# EAGLE schematic Power (EAGLE 9.6.2)
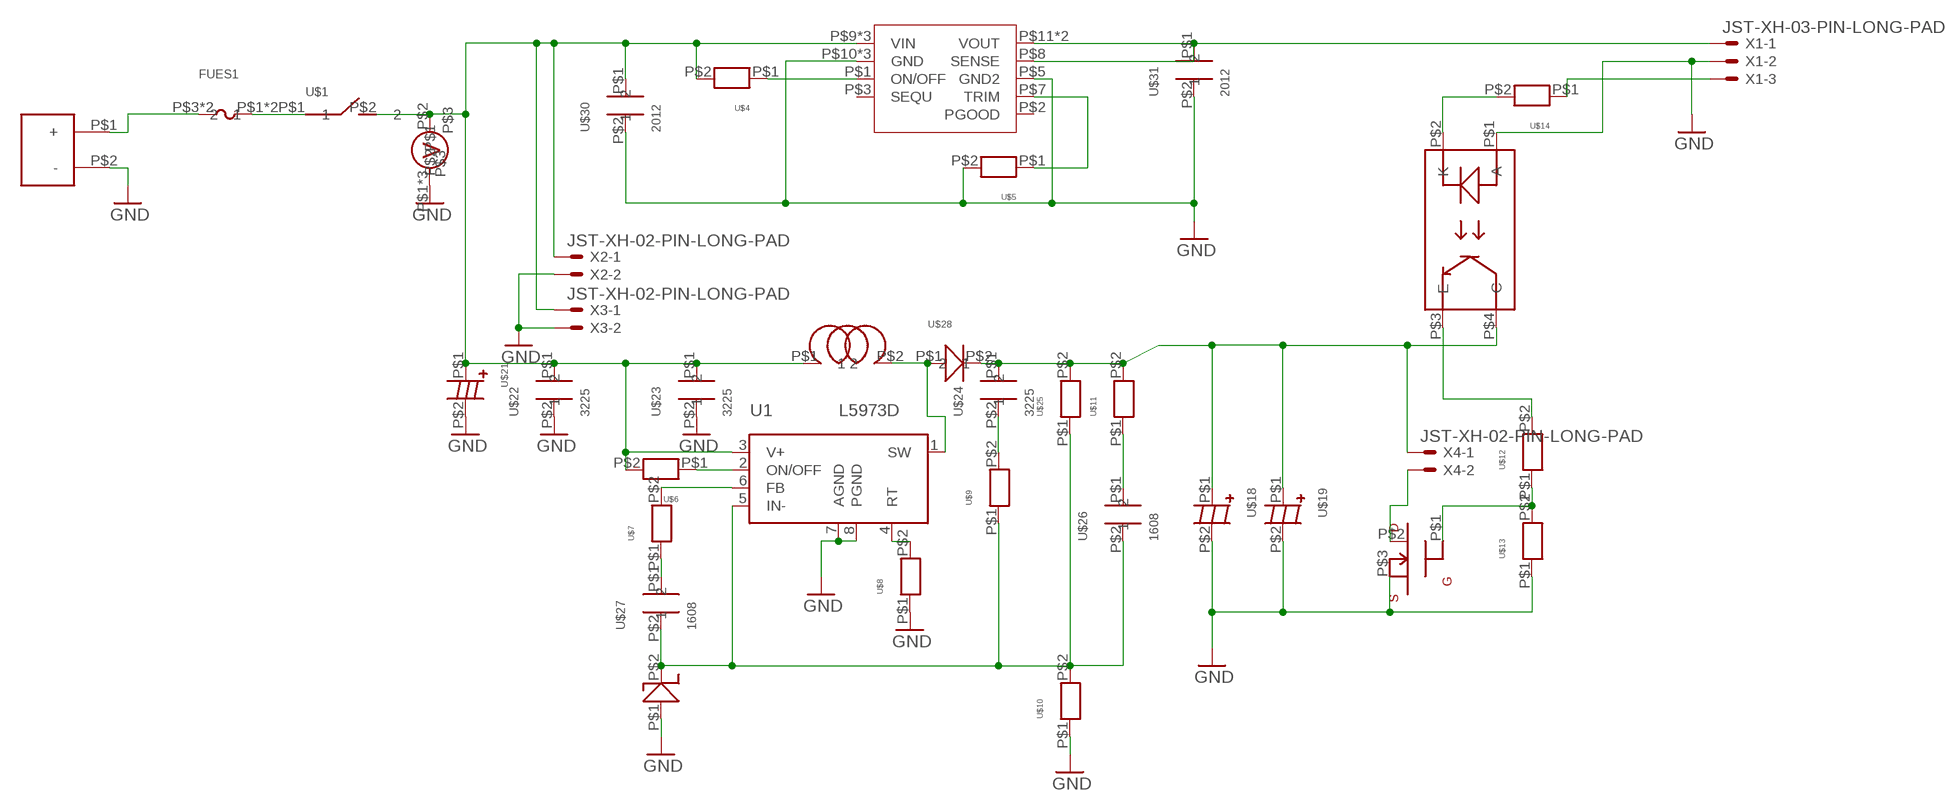
[diagram p0: schematic, sheet 1]

## Parts
FUES1  FUSE  [FUSE]
U1  L5973D  [HSOP8]
U$1  SW  [SW]
U$2  V  [V]
U$3  DCDC  [DC-DC]
U$4  R  [1608]
U$5  R  [1608]
U$6  R  [1608]
U$7  R  [1608]
U$8  R  [1608]
U$9  R  [1608]
U$10  R  [1608]
U$11  R  [1608]
U$12  R  [1608]
U$13  R  [1608]
U$14  R  [1608]
U$15  PHOTOCOUPLER  [PHOTOCOUPLER]
U$16  XT60  [XT60]
U$17  MOS  [MOS]
U$18  C  [C]
U$19  C  [C]
U$20  I  [I]
U$21  C  [C]
U$22  3225  [3225]
U$23  3225  [3225]
U$24  3225  [3225]
U$25  R  [1608]
U$26  1608  [CON]
U$27  1608  [CON]
U$28  D  [D]
U$29  TD  [TD]
U$30  2012  [2012]
U$31  2012  [2012]
X1  JST-XH-03-PIN-LONG-PAD  [JST-XH-03-PACKAGE-LONG-PAD]
X2  JST-XH-02-PIN-LONG-PAD  [JST-XH-02-PACKAGE-LONG-PAD]
X3  JST-XH-02-PIN-LONG-PAD  [JST-XH-02-PACKAGE-LONG-PAD]
X4  JST-XH-02-PIN-LONG-PAD  [JST-XH-02-PACKAGE-LONG-PAD]

## Nets
GND: U1.7(AGND) U1.8(PGND) U$2.P$1 U$2.P$4 U$2.P$5 U$3.P$5(GND2) U$3.P$10(GND) U$3.P$16(GND) U$3.P$17(GND) U$5.P$2 U$8.P$1 U$10.P$1 U$13.P$1 U$15.P$1(A) U$16.P$2(-) U$17.P$3 U$18.P$2 U$19.P$2 U$21.P$2 U$22.P$2 U$23.P$2 U$29.P$1 U$30.P$2 U$31.P$2 X1.2 X2.2 X3.2
N$1: FUES1.P$1 FUES1.P$2 U$1.P$1
N$2: FUES1.P$3 FUES1.P$4 U$16.P$1(+)
N$3: U$17.P$2 X4.2
N$4: U$12.P$1 U$13.P$2 U$17.P$1
N$5: U$12.P$2 U$15.P$3(E)
N$6: U$11.P$1 U$26.P$1
N$7: U$3.P$8(SENSE) U$3.P$11(VOUT) U$3.P$18(VOUT) U$31.P$1 X1.1
N$9: U$14.P$2 U$15.P$2(K)
N$10: U$3.P$1(ON/OFF) U$4.P$1
N$11: U1.2(ON/OFF) U$6.P$1
N$12: U1.6(FB) U$7.P$2
N$13: U$7.P$1 U$27.P$1
N$14: U$3.P$7(TRIM) U$5.P$1
N$15: U$11.P$2 U$15.P$4(C) U$18.P$1 U$19.P$1 U$24.P$1 U$25.P$2 U$28.P$2 X4.1
N$16: U$9.P$2 U$24.P$2
N$17: U1.5(IN-) U$9.P$1 U$10.P$2 U$25.P$1 U$26.P$2 U$27.P$2 U$29.P$2
N$18: U1.4(RT) U$8.P$2
N$20: U1.3(V+) U$1.P$2 U$2.P$2 U$3.P$9(VIN) U$3.P$14(VIN) U$3.P$15(VIN) U$4.P$2 U$6.P$2 U$20.P$1 U$21.P$1 U$22.P$1 U$23.P$1 U$30.P$1 X2.1 X3.1
N$21: U$14.P$1 X1.3
SW: U1.1(SW) U$20.P$2 U$28.P$1
Unconnected: U$2.P$3 U$3.P$2(PGOOD) U$3.P$3(SEQU)

## Power pins joined to a net without a drawn wire
GND: U1.9(GND)

## Library data of the parts
FUES1 = fuse:FUSE
U1 = l5973d:L5973D: 2.5A switch step down switching regulator
U$1 = SW:SW
U$2 = voltmeter:V
U$3 = OKL:DCDC
U$4-U$14 U$25 = R 1608:R
U$15 = Photo coupler:PHOTOCOUPLER
U$16 = XT60:XT60
U$17 = MOS-FET:MOS
U$18 U$19 = C 2000uF 50V:C
U$20 = Inductor:I
U$21 = C 47uF 25V:C
U$22-U$24 = con1608:3225
U$26 U$27 = con1608:1608
U$28 = D 40V2A:D
U$29 = ZD 3.9V200mW:TD
U$30 U$31 = C2012:2012
X1 = Rembrandt Electronics - JST XH Connectors v1-0:JST-XH-03-PIN: JST XH Connector 2 Pin Wire to board connector. Pitch: 2,54 mm, (0.100") Number of pins: 3 Created by Rembrandt Electronics www.rembrandtelectronics.com
X2-X4 = Rembrandt Electronics - JST XH Connectors v1-0:JST-XH-02-PIN: JST XH Connector 2 Pin Wire to board connector. Pitch: 2,54 mm, (0.100") Number of pins: 2 Created by Rembrandt Electronics www.rembrandtelectronics.com